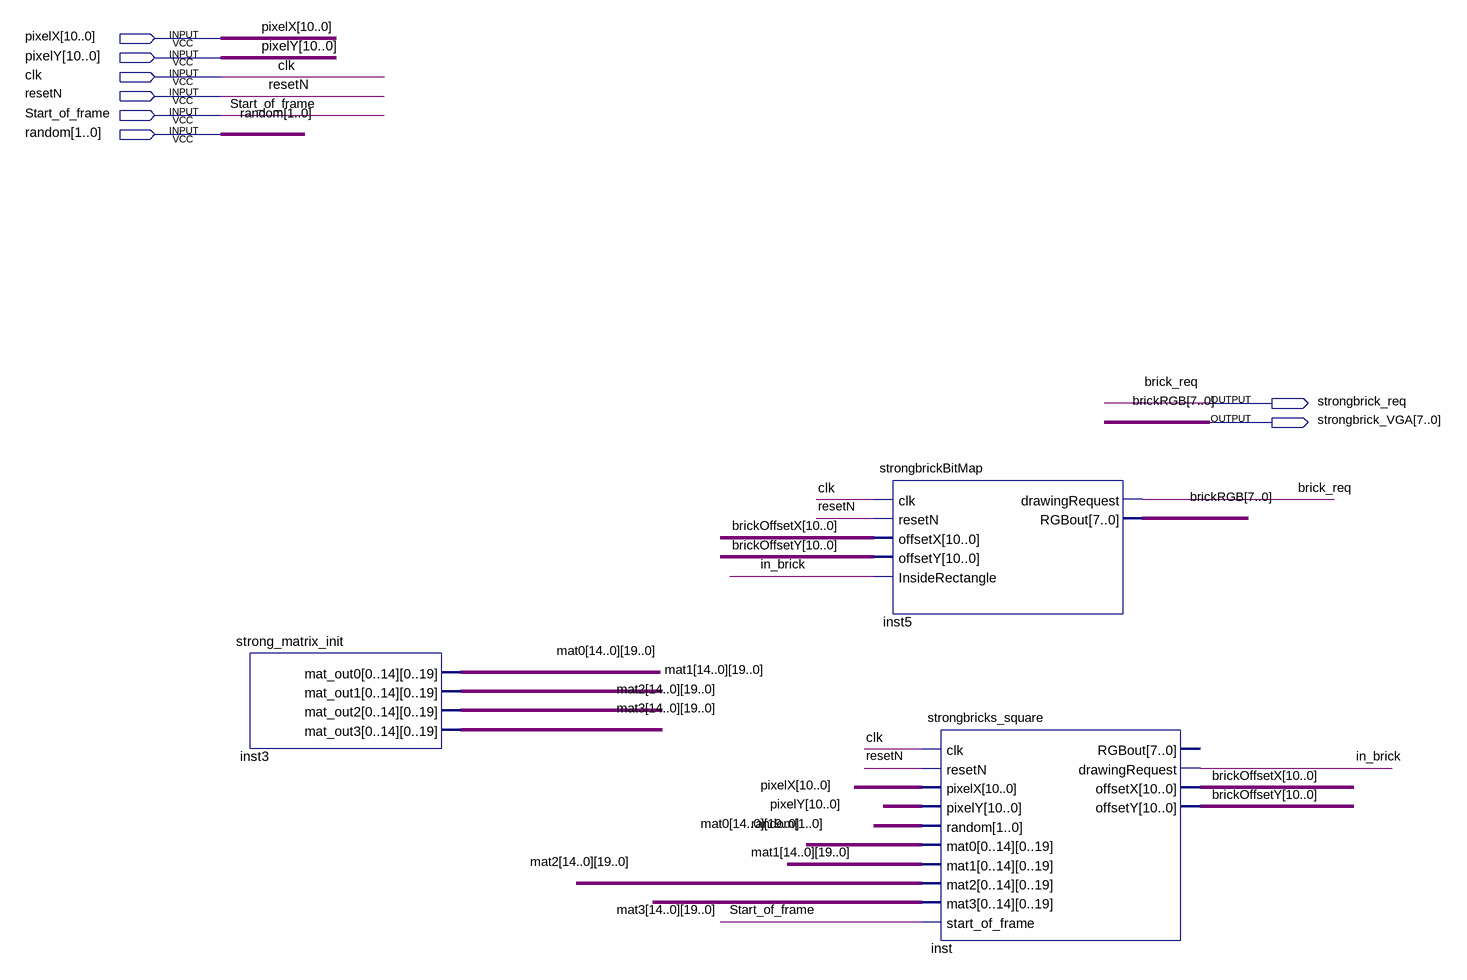
[diagram p0: schematic sheet]
// Quartus schematic strongbricks.bdf as structural Verilog: 3 symbols, 8 pins
module strongbricks (
  input  [10:0] pixelX,
  input  [10:0] pixelY,
  input  clk,
  input  resetN,
  input  Start_of_frame,
  input  [1:0] random,
  output strongbrick_req,
  output [7:0] strongbrick_VGA
);

  wire in_brick;
  wire [10:0] brickOffsetX, brickOffsetY;
  wire [19:0] mat0_0, mat0_1, mat0_2, mat0_3, mat0_4, mat0_5, mat0_6, mat0_7, mat0_8, mat0_9, mat0_10,
       mat0_11, mat0_12, mat0_13, mat0_14, mat1_0, mat1_1, mat1_2, mat1_3, mat1_4, mat1_5, mat1_6, mat1_7,
       mat1_8, mat1_9, mat1_10, mat1_11, mat1_12, mat1_13, mat1_14, mat2_0, mat2_1, mat2_2, mat2_3, mat2_4,
       mat2_5, mat2_6, mat2_7, mat2_8, mat2_9, mat2_10, mat2_11, mat2_12, mat2_13, mat2_14, mat3_0, mat3_1,
       mat3_2, mat3_3, mat3_4, mat3_5, mat3_6, mat3_7, mat3_8, mat3_9, mat3_10, mat3_11, mat3_12, mat3_13,
       mat3_14;

  strong_matrix_init inst3 (
    .mat_out0({mat0_14, mat0_13, mat0_12, mat0_11, mat0_10, mat0_9, mat0_8, mat0_7, mat0_6, mat0_5, mat0_4, mat0_3, mat0_2, mat0_1, mat0_0}),
    .mat_out1({mat1_14, mat1_13, mat1_12, mat1_11, mat1_10, mat1_9, mat1_8, mat1_7, mat1_6, mat1_5, mat1_4, mat1_3, mat1_2, mat1_1, mat1_0}),
    .mat_out2({mat2_14, mat2_13, mat2_12, mat2_11, mat2_10, mat2_9, mat2_8, mat2_7, mat2_6, mat2_5, mat2_4, mat2_3, mat2_2, mat2_1, mat2_0}),
    .mat_out3({mat3_14, mat3_13, mat3_12, mat3_11, mat3_10, mat3_9, mat3_8, mat3_7, mat3_6, mat3_5, mat3_4, mat3_3, mat3_2, mat3_1, mat3_0}));
  strongbrickBitMap inst5 (
    .clk(clk), .resetN(resetN), .offsetX(brickOffsetX), .offsetY(brickOffsetY), .InsideRectangle(in_brick),
    .drawingRequest(strongbrick_req), .RGBout(strongbrick_VGA));
  strongbricks_square inst (
    .clk(clk), .resetN(resetN), .pixelX(pixelX), .pixelY(pixelY), .random(random),
    .mat0({mat0_14, mat0_13, mat0_12, mat0_11, mat0_10, mat0_9, mat0_8, mat0_7, mat0_6, mat0_5, mat0_4, mat0_3, mat0_2, mat0_1, mat0_0}),
    .mat1({mat1_14, mat1_13, mat1_12, mat1_11, mat1_10, mat1_9, mat1_8, mat1_7, mat1_6, mat1_5, mat1_4, mat1_3, mat1_2, mat1_1, mat1_0}),
    .mat2({mat2_14, mat2_13, mat2_12, mat2_11, mat2_10, mat2_9, mat2_8, mat2_7, mat2_6, mat2_5, mat2_4, mat2_3, mat2_2, mat2_1, mat2_0}),
    .mat3({mat3_14, mat3_13, mat3_12, mat3_11, mat3_10, mat3_9, mat3_8, mat3_7, mat3_6, mat3_5, mat3_4, mat3_3, mat3_2, mat3_1, mat3_0}),
    .start_of_frame(Start_of_frame), .drawingRequest(in_brick), .offsetX(brickOffsetX), .offsetY(brickOffsetY));  // open: RGBout

  // Other names for the same wires on the sheet: brick_req = strongbrick_req; brickRGB[7:0] = strongbrick_VGA
endmodule
